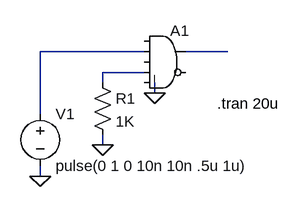
[diagram p0: schematic Gate2a.asc]
Gate2a.asc, the LTspice schematic file:
Version 4
SHEET 1 1220 680
WIRE 704 128 544 128
WIRE 832 128 768 128
WIRE 704 160 640 160
WIRE 640 176 640 160
WIRE 720 192 720 176
WIRE 544 224 544 128
WIRE 640 272 640 256
WIRE 544 320 544 304
FLAG 544 320 0
FLAG 640 272 0
FLAG 720 192 0
SYMBOL voltage 544 208 R0
SYMATTR InstName V1
SYMATTR Value pulse(0 1 0 10n 10n .5u 1u)
SYMBOL digital\\and 736 80 R0
SYMATTR InstName A1
SYMBOL res 624 160 R0
SYMATTR InstName R1
SYMATTR Value 1K
TEXT 816 208 Left 0 !.tran 20u

The netlist it stands for:
* Gate2a.asc
V1 N001 0 pulse(0 1 0 10n 10n .5u 1u)
A1 0 N001 0 N003 0 0 N002 0 AND
R1 N003 0 1K
.tran 20u
.backanno
.end